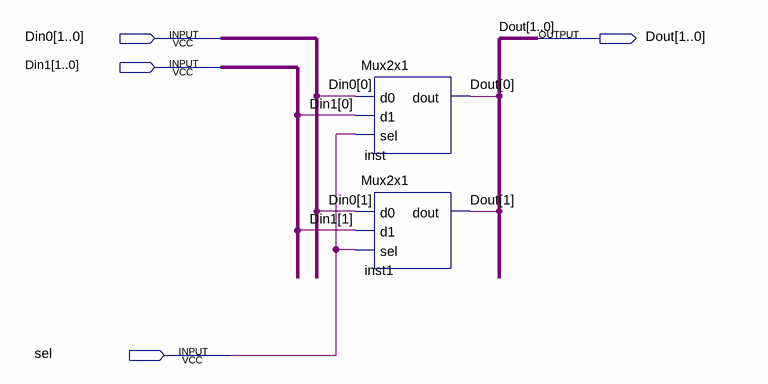
[diagram p0: schematic sheet]
// Quartus schematic Mux2bit2x1.bdf as structural Verilog: 2 symbols, 4 pins
module Mux2bit2x1 (
  input  [1:0] Din0,
  input  [1:0] Din1,
  input  sel,
  output [1:0] Dout
);

  Mux2x1 inst (.d0(Din0[0]), .d1(Din1[0]), .sel(sel), .dout(Dout[0]));
  Mux2x1 inst1 (.d0(Din0[1]), .d1(Din1[1]), .sel(sel), .dout(Dout[1]));
endmodule
